# EAGLE design 1pil-2motor-1back (EAGLE 9.6.2)
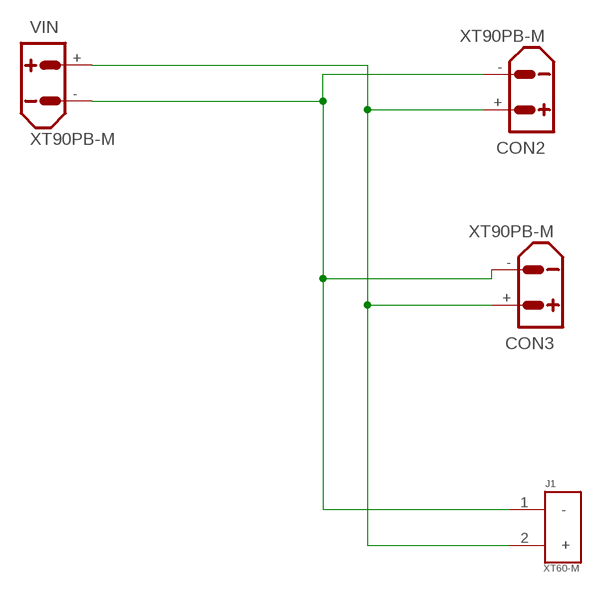
[diagram p0: schematic, sheet 1]

## Parts
CON2  XT90PB-M  [XT90PB-M]
CON3  XT90PB-M  [XT90PB-M]
J1  XT60-M  [AMASS_XT60-M]
VIN  XT90PB-M  [XT90PB-M]

## Nets
N$1: CON2.+ CON3.+ J1.2(+) VIN.+
N$2: CON2.- CON3.- J1.1(-) VIN.-

## Library data of the parts
CON2 CON3 VIN = amass:XT90: AMASS XT90 connector Store in Japan AMASS XT90 connector <https://szc.jp/ams-xt90>
J1 = XT60-M:XT60-M: DC supply; XT60; male; PIN:2; for cable; soldered; 60A; 500V; AVAILABILITY: Unavailable; DESCRIPTION: Plug; DC supply; XT60; male; PIN: 2; for cable; soldered; 30A; 500V; MF: AMASS; MP: XT60-M; PACKAGE: Package; PRICE: None

## Board
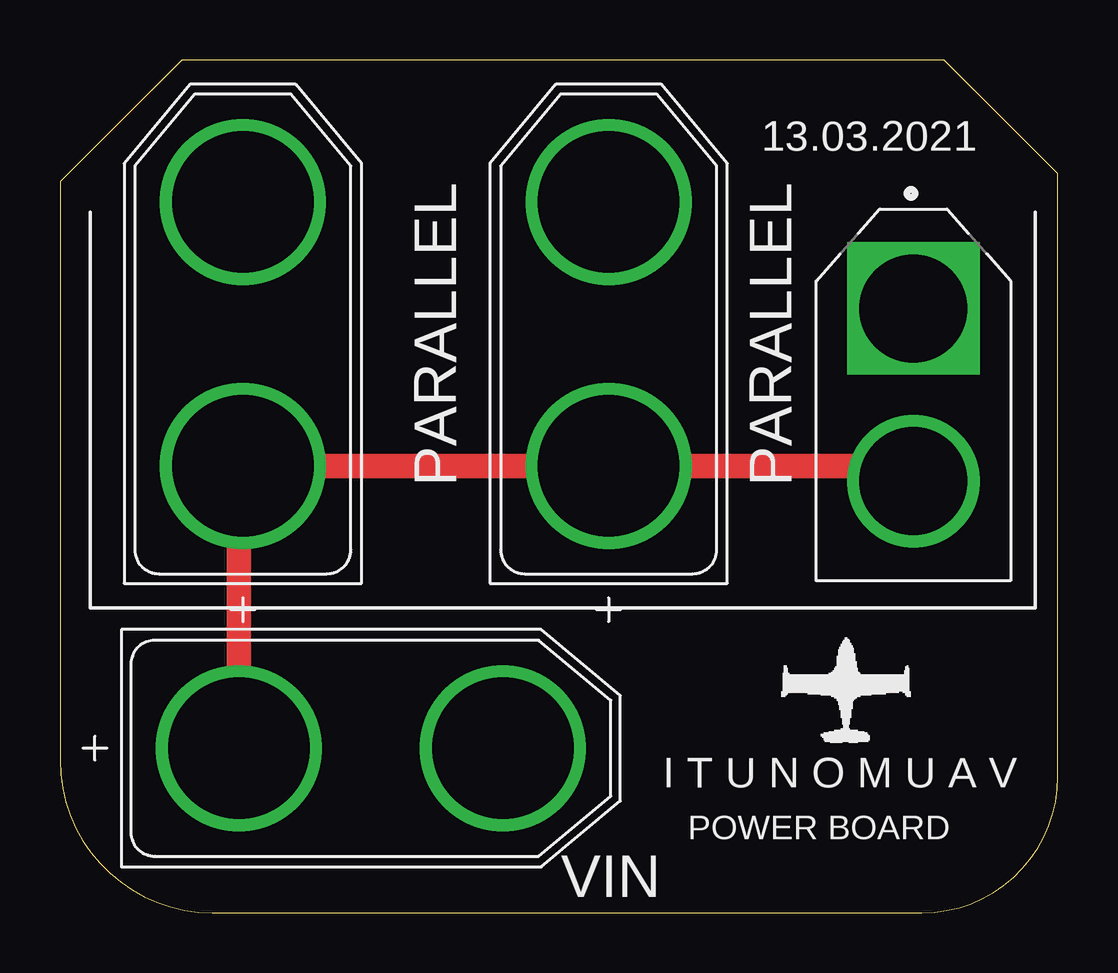
[diagram p1: board, top side]
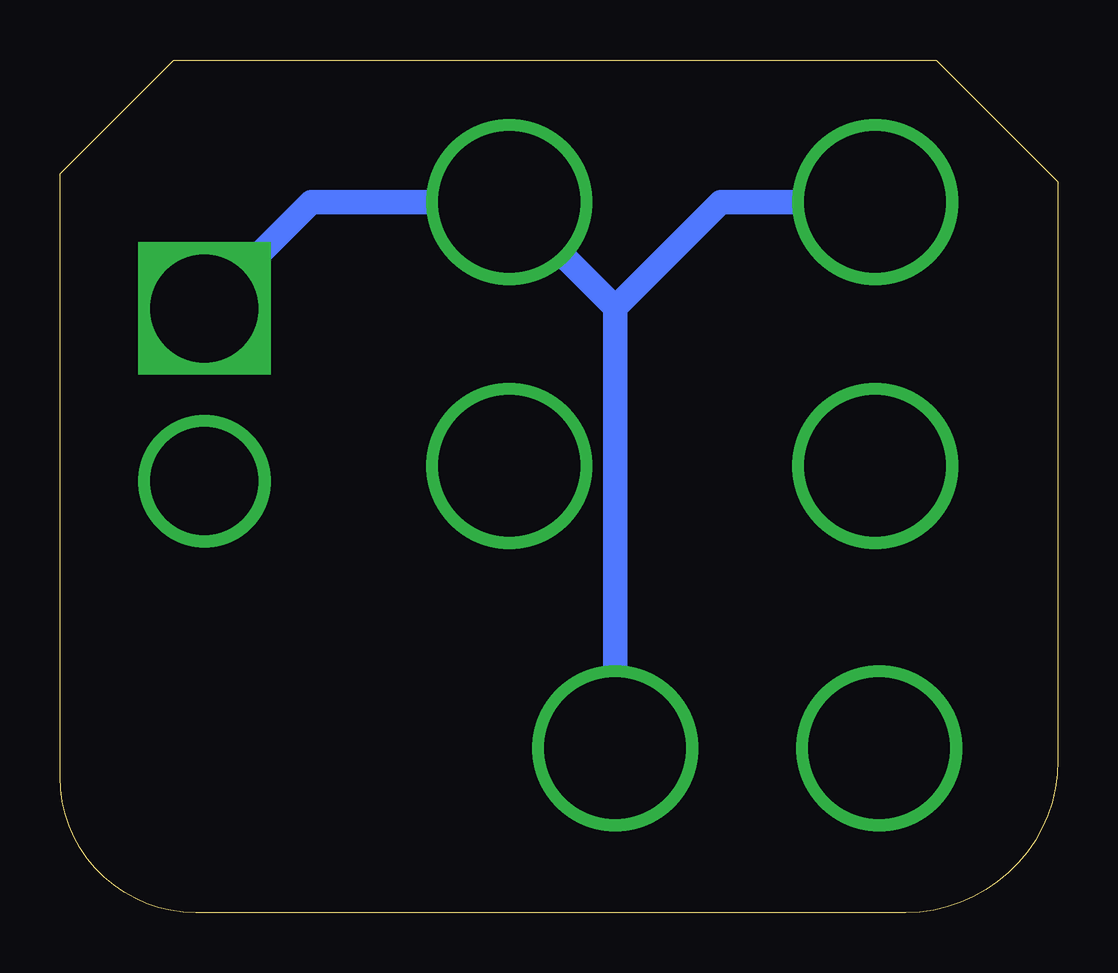
[diagram p2: board, bottom side, seen from below]

Size 41.58 x 35.55 mm. Coordinates in mm from the lower left corner, seen from the top.
Outline: 41.58,5.67 41.58,30.81 36.84,35.55 5.07,35.55 0,30.48 0,6.35 arc90 6.35,0 35.91,0 arc90 41.58,5.67
Copper layers (1*16): Top 0.035mm / dielectric 1.5mm / Bottom 0.035mm
Design rules "default": minimum track width 6mil, minimum drill 0.35mm, track to track 6mil, track to pad 6mil, pad to pad 6mil, via to via 6mil, smd to smd 6mil, copper to edge 40mil, drill to drill 6mil, minimum pad ring 10mil, minimum via ring 8mil, stop-mask expansion 4mil, vias tented up to drill 0mil, thermal gap 10mil

### Footprints (pad centres in the part's own frame; a part is rotated, then mirrored left to right if it is on the bottom)
XT90PB-M = drill 5.9: + 5.5,0; - -5.5,0
AMASS_XT60-M = drill 4.5 square: 1 -3.6,0 | drill 4.5: 2 3.6,0

### Placement (x,y rotation side)
CON2  22.86,24.13 270 top
CON3  7.62,24.13 270 top
J1  35.56,21.59 270 top
VIN  12.95,6.86 180 top

### Tracks (layer width: path | path; a pad name or v marks a point on that pad's centre or on a via)
N$1
  Top 1.016: VIN.+ 7.45,18.46 CON3.+ CON2.+ 34.92,18.63 J1.2
N$2
  Bottom 1.016: VIN.- 18.45,25.22 | 18.45,25.22 CON2.- 31.12,29.63 J1.1 | 18.45,25.22 14.05,29.63 CON3.-

### Text on the board
tNames: 13.03.2021 | PARALLEL | PARALLEL | I T U N O M U A V | POWER BOARD